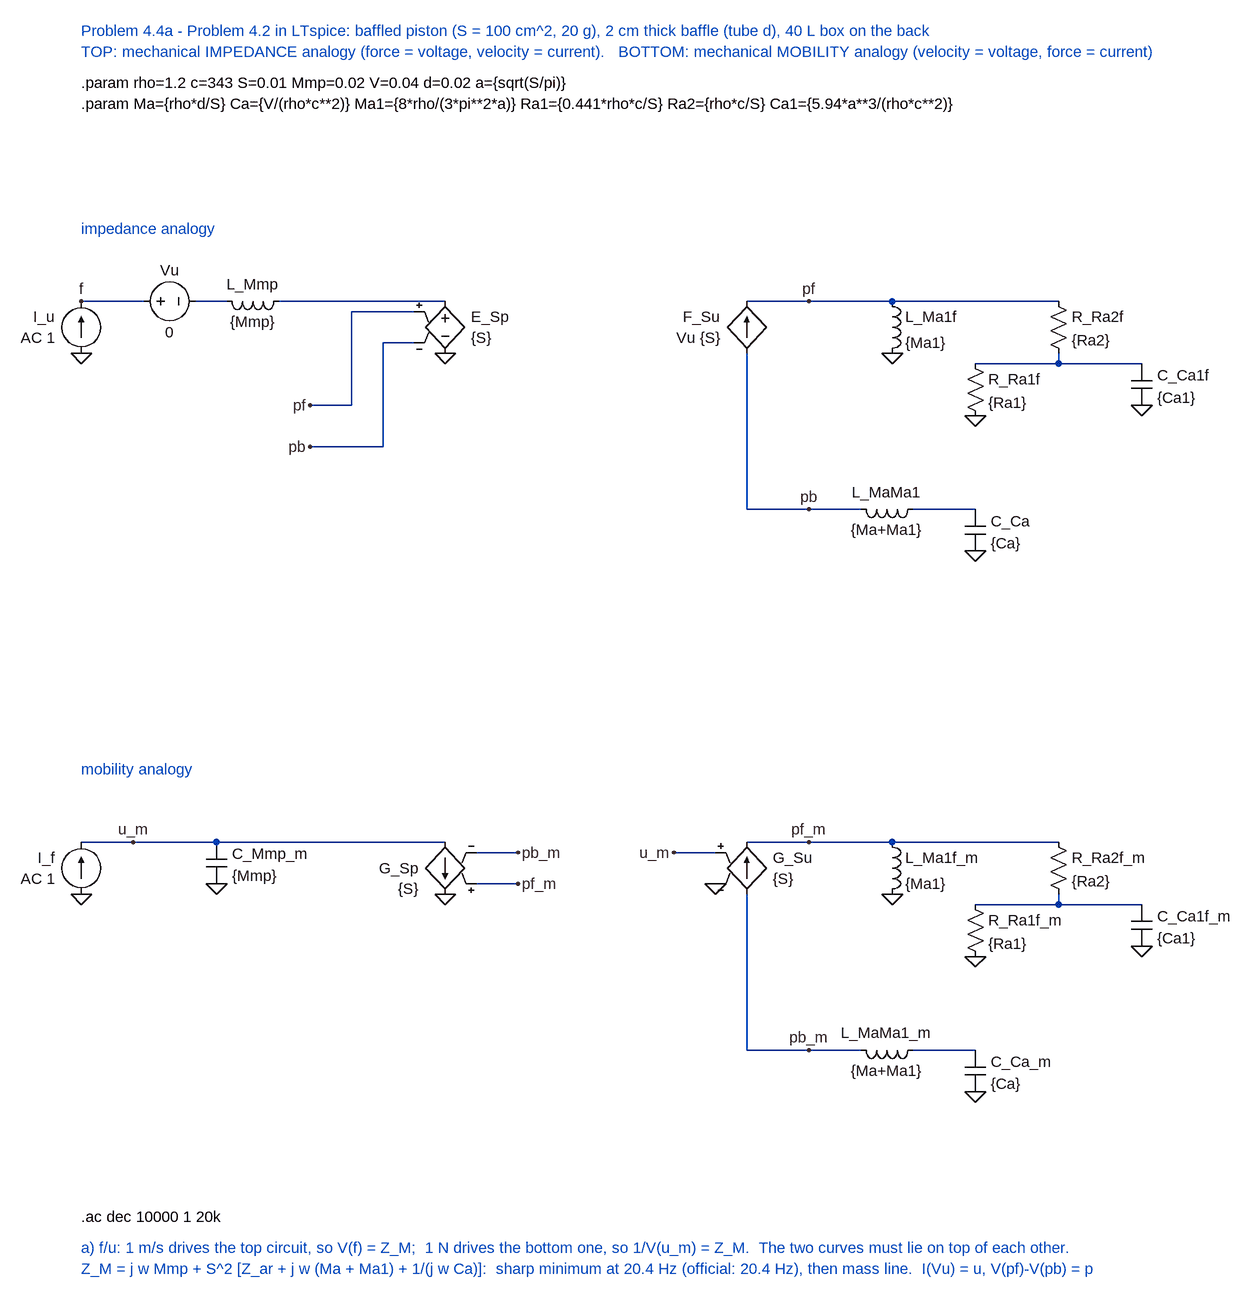
[diagram p0: schematic P4-4a_Piston_Box.asc]
P4-4a_Piston_Box.asc, the LTspice schematic file:
Version 4
SHEET 1 3000 1600
WIRE 0 0 96 0
WIRE 176 0 224 0
WIRE 304 0 560 0
WIRE 512 16 416 16
WIRE 416 16 416 160
WIRE 416 160 352 160
WIRE 512 64 464 64
WIRE 464 64 464 224
WIRE 464 224 352 224
WIRE 1024 80 1024 320
WIRE 1504 80 1504 96
WIRE 1376 96 1632 96
WIRE 1024 0 1504 0
WIRE 1024 320 1200 320
WIRE 1280 320 1376 320
WIRE 0 832 560 832
WIRE 608 896 672 896
WIRE 608 848 672 848
WIRE 1024 912 1024 1152
WIRE 976 848 912 848
WIRE 1504 912 1504 928
WIRE 1376 928 1632 928
WIRE 1024 832 1504 832
WIRE 1024 1152 1200 1152
WIRE 1280 1152 1376 1152
FLAG 0 80 0
FLAG 0 0 f
FLAG 560 80 0
FLAG 352 160 pf
FLAG 352 224 pb
FLAG 1120 0 pf
FLAG 1120 320 pb
FLAG 1248 80 0
FLAG 1376 176 0
FLAG 1632 160 0
FLAG 1376 384 0
FLAG 0 912 0
FLAG 80 832 u_m
FLAG 208 896 0
FLAG 560 912 0
FLAG 672 896 pf_m
FLAG 672 848 pb_m
FLAG 912 848 u_m
FLAG 976 896 0
FLAG 1120 832 pf_m
FLAG 1120 1152 pb_m
FLAG 1248 912 0
FLAG 1376 1008 0
FLAG 1632 992 0
FLAG 1376 1216 0
SYMBOL current 0 80 R180
WINDOW 0 40 56 Left 2
WINDOW 3 40 24 Left 2
SYMATTR InstName I_u
SYMATTR Value AC 1
SYMBOL voltage 80 0 R270
WINDOW 0 32 56 VTop 2
WINDOW 3 -32 56 VBottom 2
SYMATTR InstName Vu
SYMATTR Value 0
SYMBOL ind 320 -16 R90
WINDOW 0 5 56 VBottom 2
WINDOW 3 32 56 VTop 2
SYMATTR InstName L_Mmp
SYMATTR Value {Mmp}
SYMATTR SpiceLine Rser=0
SYMBOL e 560 -16 R0
WINDOW 0 40 40 Left 2
WINDOW 3 40 72 Left 2
SYMATTR InstName E_Sp
SYMATTR Value {S}
SYMBOL f 1024 80 R180
WINDOW 0 40 56 Left 2
WINDOW 3 40 24 Left 2
SYMATTR InstName F_Su
SYMATTR Value Vu {S}
SYMBOL ind 1232 -16 R0
SYMATTR InstName L_Ma1f
SYMATTR Value {Ma1}
SYMATTR SpiceLine Rser=0
SYMBOL res 1488 -16 R0
SYMATTR InstName R_Ra2f
SYMATTR Value {Ra2}
SYMBOL res 1360 80 R0
SYMATTR InstName R_Ra1f
SYMATTR Value {Ra1}
SYMBOL cap 1616 96 R0
WINDOW 0 40 18 Left 2
WINDOW 3 40 52 Left 2
SYMATTR InstName C_Ca1f
SYMATTR Value {Ca1}
SYMBOL ind 1296 304 R90
WINDOW 0 5 56 VBottom 2
WINDOW 3 32 56 VTop 2
SYMATTR InstName L_MaMa1
SYMATTR Value {Ma+Ma1}
SYMATTR SpiceLine Rser=0
SYMBOL cap 1360 320 R0
WINDOW 0 40 18 Left 2
WINDOW 3 40 52 Left 2
SYMATTR InstName C_Ca
SYMATTR Value {Ca}
SYMBOL current 0 912 R180
WINDOW 0 40 56 Left 2
WINDOW 3 40 24 Left 2
SYMATTR InstName I_f
SYMATTR Value AC 1
SYMBOL cap 192 832 R0
WINDOW 0 40 18 Left 2
WINDOW 3 40 52 Left 2
SYMATTR InstName C_Mmp_m
SYMATTR Value {Mmp}
SYMBOL g 560 928 R180
WINDOW 0 40 56 Left 2
WINDOW 3 40 24 Left 2
SYMATTR InstName G_Sp
SYMATTR Value {S}
SYMBOL g 1024 816 R0
WINDOW 0 40 40 Left 2
WINDOW 3 40 72 Left 2
SYMATTR InstName G_Su
SYMATTR Value {S}
SYMBOL ind 1232 816 R0
SYMATTR InstName L_Ma1f_m
SYMATTR Value {Ma1}
SYMATTR SpiceLine Rser=0
SYMBOL res 1488 816 R0
SYMATTR InstName R_Ra2f_m
SYMATTR Value {Ra2}
SYMBOL res 1360 912 R0
SYMATTR InstName R_Ra1f_m
SYMATTR Value {Ra1}
SYMBOL cap 1616 928 R0
WINDOW 0 40 18 Left 2
WINDOW 3 40 52 Left 2
SYMATTR InstName C_Ca1f_m
SYMATTR Value {Ca1}
SYMBOL ind 1296 1136 R90
WINDOW 0 5 56 VBottom 2
WINDOW 3 32 56 VTop 2
SYMATTR InstName L_MaMa1_m
SYMATTR Value {Ma+Ma1}
SYMATTR SpiceLine Rser=0
SYMBOL cap 1360 1152 R0
WINDOW 0 40 18 Left 2
WINDOW 3 40 52 Left 2
SYMATTR InstName C_Ca_m
SYMATTR Value {Ca}
TEXT 0 -416 Left 2 ;Problem 4.4a - Problem 4.2 in LTspice: baffled piston (S = 100 cm^2, 20 g), 2 cm thick baffle (tube d), 40 L box on the back
TEXT 0 -384 Left 2 ;TOP: mechanical IMPEDANCE analogy (force = voltage, velocity = current).   BOTTOM: mechanical MOBILITY analogy (velocity = voltage, force = current)
TEXT 0 -336 Left 2 !.param rho=1.2 c=343 S=0.01 Mmp=0.02 V=0.04 d=0.02 a={sqrt(S/pi)}
TEXT 0 -304 Left 2 !.param Ma={rho*d/S} Ca={V/(rho*c**2)} Ma1={8*rho/(3*pi**2*a)} Ra1={0.441*rho*c/S} Ra2={rho*c/S} Ca1={5.94*a**3/(rho*c**2)}
TEXT 0 -112 Left 2 ;impedance analogy
TEXT 0 720 Left 2 ;mobility analogy
TEXT 0 1408 Left 2 !.ac dec 10000 1 20k
TEXT 0 1456 Left 2 ;a) f/u: 1 m/s drives the top circuit, so V(f) = Z_M;  1 N drives the bottom one, so 1/V(u_m) = Z_M.  The two curves must lie on top of each other.
TEXT 0 1488 Left 2 ;Z_M = j w Mmp + S^2 [Z_ar + j w (Ma + Ma1) + 1/(j w Ca)]:  sharp minimum at 20.4 Hz (official: 20.4 Hz), then mass line.  I(Vu) = u, V(pf)-V(pb) = p

The netlist it stands for:
* P4-4a_Piston_Box.asc
I_u 0 f AC 1
Vu f N001 0
L_Mmp N002 N001 {Mmp} Rser=0
E_Sp N002 0 pf pb {S}
F_Su pb pf Vu {S}
L_Ma1f pf 0 {Ma1} Rser=0
R_Ra2f pf N003 {Ra2}
R_Ra1f N003 0 {Ra1}
C_Ca1f N003 0 {Ca1}
L_MaMa1 N004 pb {Ma+Ma1} Rser=0
C_Ca N004 0 {Ca}
I_f 0 u_m AC 1
C_Mmp_m u_m 0 {Mmp}
G_Sp u_m 0 pf_m pb_m {S}
G_Su pb_m pf_m u_m 0 {S}
L_Ma1f_m pf_m 0 {Ma1} Rser=0
R_Ra2f_m pf_m N005 {Ra2}
R_Ra1f_m N005 0 {Ra1}
C_Ca1f_m N005 0 {Ca1}
L_MaMa1_m N006 pb_m {Ma+Ma1} Rser=0
C_Ca_m N006 0 {Ca}
* Problem 4.4a - Problem 4.2 in LTspice: baffled piston (S = 100 cm^2, 20 g), 2 cm thick baffle (tube d), 40 L box on the back
* TOP: mechanical IMPEDANCE analogy (force = voltage, velocity = current).   BOTTOM: mechanical MOBILITY analogy (velocity = voltage, force = current)
.param rho=1.2 c=343 S=0.01 Mmp=0.02 V=0.04 d=0.02 a={sqrt(S/pi)}
.param Ma={rho*d/S} Ca={V/(rho*c**2)} Ma1={8*rho/(3*pi**2*a)} Ra1={0.441*rho*c/S} Ra2={rho*c/S} Ca1={5.94*a**3/(rho*c**2)}
* impedance analogy
* mobility analogy
.ac dec 10000 1 20k
* a) f/u: 1 m/s drives the top circuit, so V(f) = Z_M;  1 N drives the bottom one, so 1/V(u_m) = Z_M.  The two curves must lie on top of each other.
* Z_M = j w Mmp + S^2 [Z_ar + j w (Ma + Ma1) + 1/(j w Ca)]:  sharp minimum at 20.4 Hz (official: 20.4 Hz), then mass line.  I(Vu) = u, V(pf)-V(pb) = p
.backanno
.end